# Altium schematic sheet Sheet2.SchDoc
size A; SheetNumber: 1; SheetTotal: 1
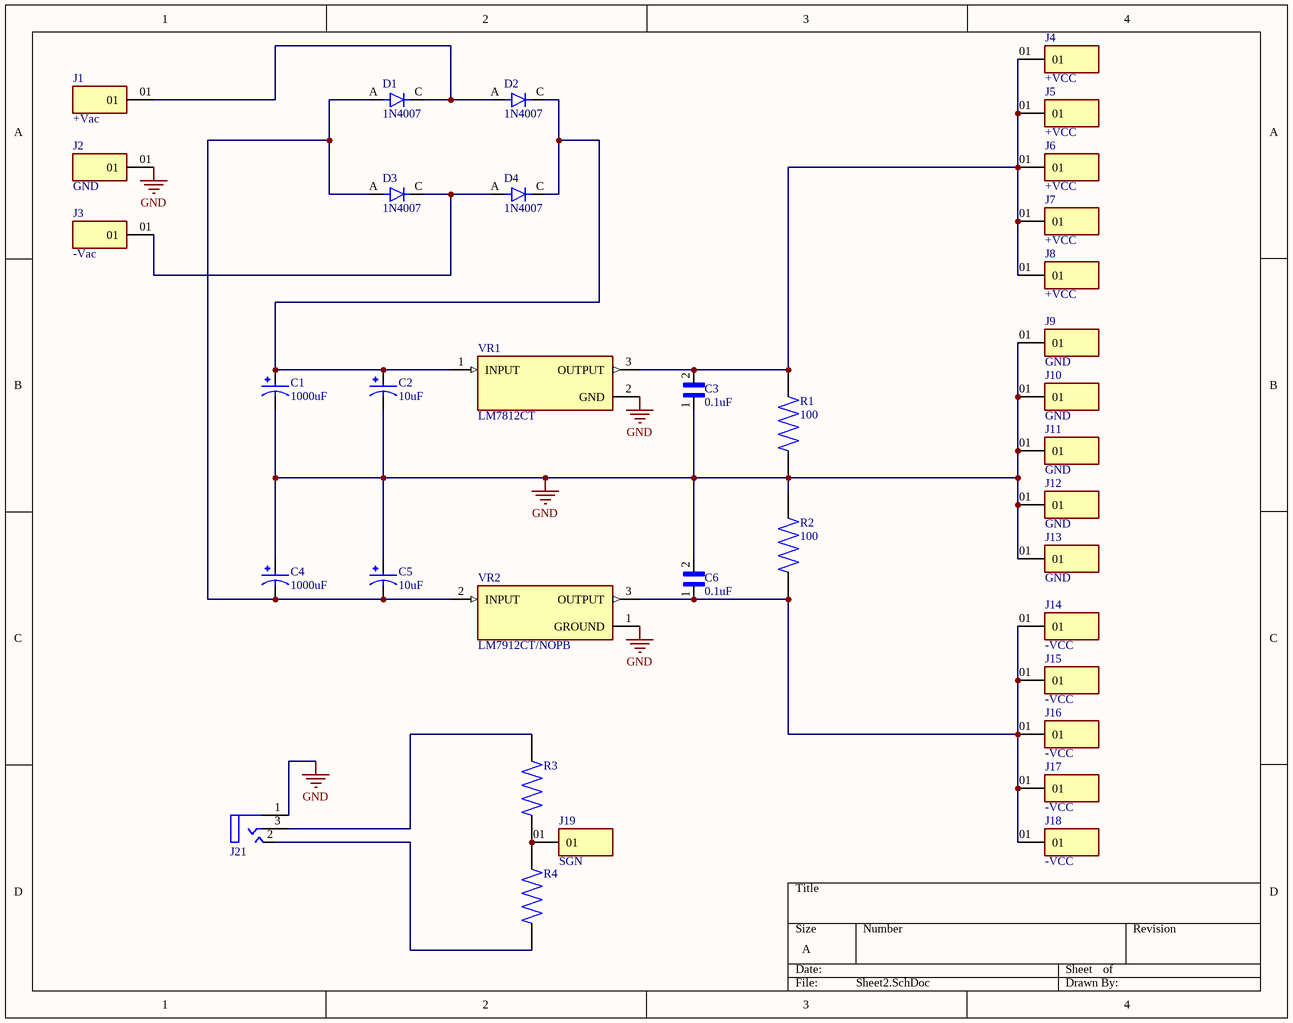
[diagram p0: Sheet2.SchDoc]

## Parts
C1  1000uF  [CAPPRD750W80D1800H2500]
C2  10uF  [CAPPRD750W80D1800H2500]
C3  0.1uF  [CAPRB500W50L550T350H600]
C4  1000uF  [CAPPRD750W80D1800H2500]
C5  10uF  [CAPPRD750W80D1800H2500]
C6  0.1uF  [CAPRB500W50L550T350H600]
D1  1N4007  [DIOAD1060W80L520D270]
D2  1N4007  [DIOAD1060W80L520D270]
D3  1N4007  [DIOAD1060W80L520D270]
D4  1N4007  [DIOAD1060W80L520D270]
J1  +Vac  [SAMTEC_MTMM-101-XX-X-S-XXX]
J2  GND  [SAMTEC_MTMM-101-XX-X-S-XXX]
J3  -Vac  [SAMTEC_MTMM-101-XX-X-S-XXX]
J4  +VCC  [SAMTEC_MTMM-101-XX-X-S-XXX]
J5  +VCC  [SAMTEC_MTMM-101-XX-X-S-XXX]
J6  +VCC  [SAMTEC_MTMM-101-XX-X-S-XXX]
J7  +VCC  [SAMTEC_MTMM-101-XX-X-S-XXX]
J8  +VCC  [SAMTEC_MTMM-101-XX-X-S-XXX]
J9  GND  [SAMTEC_MTMM-101-XX-X-S-XXX]
J10  GND  [SAMTEC_MTMM-101-XX-X-S-XXX]
J11  GND  [SAMTEC_MTMM-101-XX-X-S-XXX]
J12  GND  [SAMTEC_MTMM-101-XX-X-S-XXX]
J13  GND  [SAMTEC_MTMM-101-XX-X-S-XXX]
J14  -VCC  [SAMTEC_MTMM-101-XX-X-S-XXX]
J15  -VCC  [SAMTEC_MTMM-101-XX-X-S-XXX]
J16  -VCC  [SAMTEC_MTMM-101-XX-X-S-XXX]
J17  -VCC  [SAMTEC_MTMM-101-XX-X-S-XXX]
J18  -VCC  [SAMTEC_MTMM-101-XX-X-S-XXX]
J19  SGN  [SAMTEC_MTMM-101-XX-X-S-XXX]
J21  SJ1-3523N  [CUI_Devices_0_MFG]  (value not drawn)
R1  100  [RESAD1100W55L680D260]
R2  100  [RESAD1100W55L680D260]
R3  MFR-25FBF52-1K  [RESAD1100W55L680D260]  (value not drawn)
R4  MFR-25FBF52-1K  [RESAD1100W55L680D260]  (value not drawn)
VR1  LM7812CT  [TO253P1057X470X2040-3]
VR2  LM7912CT/NOPB  [TO254P1054X470X1955-3]

## Nets
GND: C1.N C2.N C3.1 C4.P C5.P C6.2 J2.01 J9.01 J10.01 J11.01 J12.01 J13.01 J21.1(sleeve) R1.1 R2.2 VR1.2(GND) VR2.1(GROUND)
NetC1_P: C1.P C2.P D2.C D4.C VR1.1(INPUT)
NetC3_2: C3.2 J4.01 J5.01 J6.01 J7.01 J8.01 R1.2 VR1.3(OUTPUT)
NetC4_N: C4.N C5.N D1.A D3.A VR2.2(INPUT)
NetC6_1: C6.1 J14.01 J15.01 J16.01 J17.01 J18.01 R2.1 VR2.3(OUTPUT)
NetD1_C: D1.C D2.A J1.01
NetD3_C: D3.C D4.A J3.01
NetJ19_01: J19.01 R3.1 R4.2
NetJ21_2: J21.2(tip) R4.1
NetJ21_3: J21.3(ring) R3.2

## Library data of the parts
C1 C2 C4 C5 = EEUEE2V820S: CAP ALUM 82UF 20% 350V RADIAL; MP: EEU-EE2V820S; MF: Panasonic Electronic; Value: *; Check_prices: https://www.snapeda.com/parts/EEU-EE2V820S/Panasonic+Electronic+Components/view-part/?ref=eda; Availability: In Stock; Price: None; Package: RADIAL-2 Panasonic; SnapEDA_Link: https://www.snapeda.com/parts/EEU-EE2V820S/Panasonic+Electronic+Components/view-part/?ref=snap; Purchase-URL: https://pricing.snapeda.com/search/part/EEU-EE2V820S/?ref=eda
C3 C6 = FG26X7R2E104KNT06: 0.1ÂµF Â±10% 250V Ceramic Capacitor X7R Radial; MF: TDK; Purchase-URL: https://pricing.snapeda.com/search/part/FG26X7R2E104KNT06/?ref=eda; Package: Radial TDK; Availability: In Stock; Value: *; MP: FG26X7R2E104KNT06; Check_prices: https://www.snapeda.com/parts/FG26X7R2E104KNT06/TDK/view-part/?ref=eda; Price: None; SnapEDA_Link: https://www.snapeda.com/parts/FG26X7R2E104KNT06/TDK/view-part/?ref=snap
D1-D4 = 1N4007: Diode Switching 1KV 1A 2-Pin DO-41; Price: None; MP: 1N4007; Value: *; Availability: Unavailable; Package: None
J1-J19 = MTMM-101-XX-X-S-XXX: Connector Header position; Package: None; MP: MTMM-101-XX-X-S-XXX; Value: *; Availability: Unavailable; Price: None
R1-R4 = MFR-25FBF52-1K: 1.78 kOhms Â±1% 0.25W, 1/4W Through Hole Resistor Axial - Metal Film; MF: Yageo; Package: Axial Yageo; Check_prices: https://www.snapeda.com/parts/MFR-25FBF52-1K/Yageo/view-part/?ref=eda; Availability: In Stock; MP: MFR-25FBF52-1K; Value: *; Purchase-URL: https://pricing.snapeda.com/search/part/MFR-25FBF52-1K/?ref=eda; Price: None; SnapEDA_Link: https://www.snapeda.com/parts/MFR-25FBF52-1K/Yageo/view-part/?ref=snap
VR1 = LM7812CT: Linear Voltage Regulator IC Positive Fixed 1 Output  1A TO-220-3; MF: ON Semiconductor; Package: TO-220; MP: LM7812CT; Check_prices: https://www.snapeda.com/parts/LM7812CT/Onsemi/view-part/?ref=eda; Value: *; Price: None; Availability: Unavailable; SnapEDA_Link: https://www.snapeda.com/parts/LM7812CT/Onsemi/view-part/?ref=snap
VR2 = LM7912CT/NOPB: 1.5-A, negative linear voltage regulator; MF: Texas Instruments; Availability: In Stock; SnapEDA_Link: https://www.snapeda.com/parts/LM7912CT/NOPB/Texas+Instruments/view-part/?ref=snap; Price: None; Check_prices: https://www.snapeda.com/parts/LM7912CT/NOPB/Texas+Instruments/view-part/?ref=eda; Package: TO-220-3 Texas Instruments; MP: LM7912CT/NOPB; Value: *; Purchase-URL: https://pricing.snapeda.com/search/part/LM7912CT/NOPB/?ref=eda